# EAGLE design e0-dev-v004 (EAGLE 8.2.2)
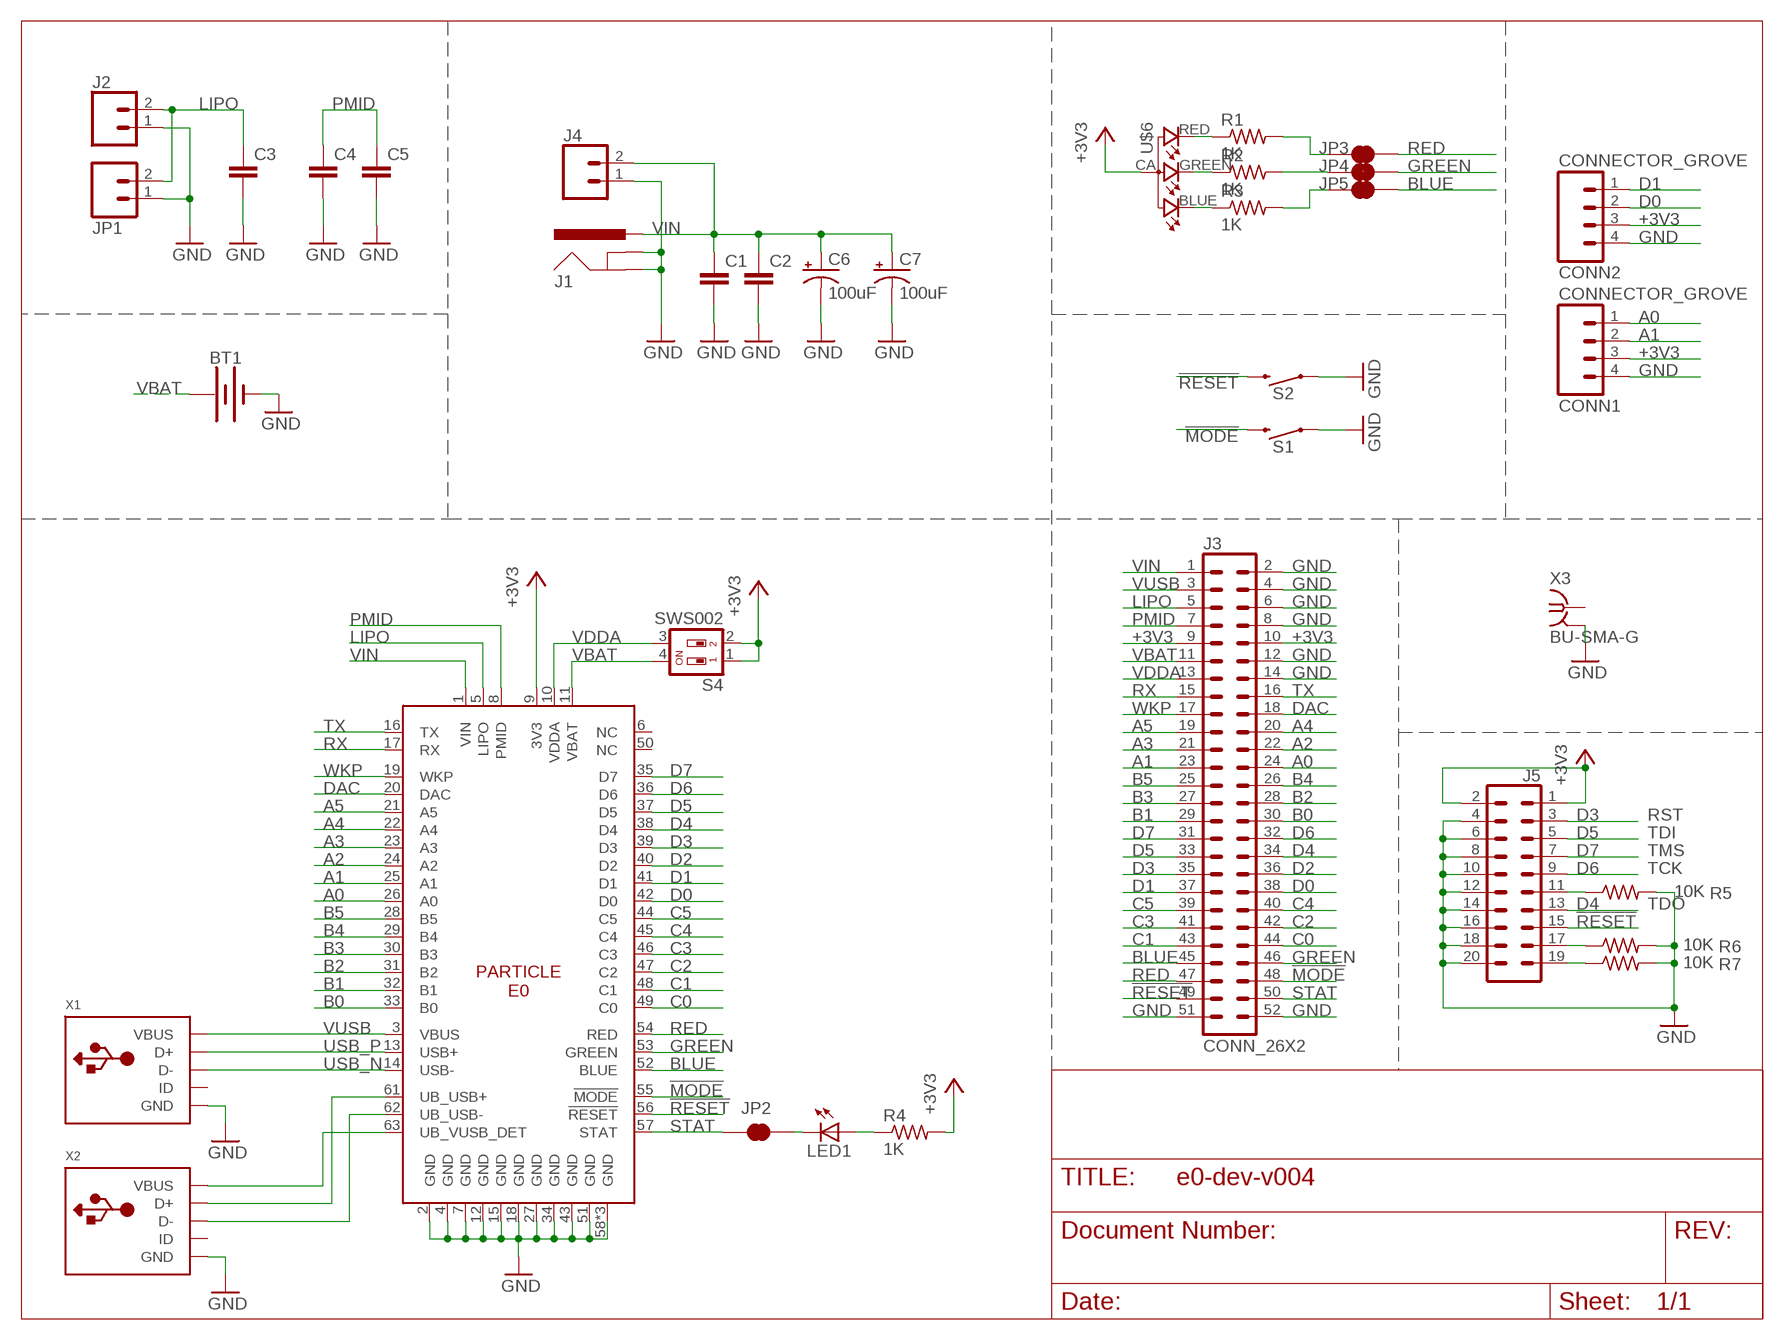
[diagram p0: schematic, sheet 1]

## Parts
BT1  BATTERY-20MM_SMD  [BATTCON_20MM]
C1  C-EUC0805  [C0805]
C2  C-EUC0805  [C0805]
C3  C-EUC0805  [C0805]
C4  C-EUC0805  [C0805]
C5  C-EUC0805  [C0805]
C6  100uF  100UF-POLAR-25V-20%(ELEC)  [PANASONIC_D]
C7  100uF  100UF-POLAR-25V-20%(ELEC)  [PANASONIC_D]
CONN1  CONNECTOR_GROVE  [CONNCTOR_GROVE]
CONN2  CONNECTOR_GROVE  [CONNCTOR_GROVE]
J1  POWER_JACKSLT  [POWER_JACK_SLOT]
J2  CONN_021X02_NO_SILK  [1X02_NO_SILK]
J3  CONN_26X2  [2X26]
J4  CONN_021X02_NO_SILK  [1X02_NO_SILK]
J5  CONN_10X2NOSILK  [2X10_NOSILK]
JP1  M02-JST-2MM-SMT  [JST-2-SMD@1]
JP2  JUMPER-SMT_2_NC_TRACE_NO-SILK  [SMT-JUMPER_2_NC_TRACE_NO-SILK]
JP3  JUMPER-SMT_2_NC_TRACE_NO-SILK  [SMT-JUMPER_2_NC_TRACE_NO-SILK]
JP4  JUMPER-SMT_2_NC_TRACE_NO-SILK  [SMT-JUMPER_2_NC_TRACE_NO-SILK]
JP5  JUMPER-SMT_2_NC_TRACE_NO-SILK  [SMT-JUMPER_2_NC_TRACE_NO-SILK]
LED1  LED0603  [LED-0603]
R1  1K  R-US_R0603  [R0603]
R2  1K  R-US_R0603  [R0603]
R3  1K  R-US_R0603  [R0603]
R4  1K  R-US_R0603  [R0603]
R5  10K  R-US_R0603  [R0603]
R6  10K  R-US_R0603  [R0603]
R7  10K  R-US_R0603  [R0603]
S1  MOMENTARY-SWITCH-SPST-SMD-5.2MM  [TACTILE_SWITCH_SMD_5.2MM]
S2  MOMENTARY-SWITCH-SPST-SMD-5.2MM  [TACTILE_SWITCH_SMD_5.2MM]
S4  SWS002  [SMS-002]
U1  E0_V005  [E0]
U$6  RGB-LED-CLMVB-FKARGB  [PLCC4-2MM-RGB]
X1  USB-NEW-PHOTON  [4UCONN_CMCUSB-5BFM14X-01-X]
X2  USB-NEW-PHOTON  [4UCONN_CMCUSB-5BFM14X-01-X]
X3  BU-SMA-G  [BU-SMA-G]

## Nets
!MODE: J3.48 S1.3 U1.55(!MODE)
!RESET: J3.49 J5.15 S2.3 U1.56(!RESET)
+3V3 [3V3]: CONN1.3 CONN2.3 J3.9 J3.10 J5.1 J5.2 R4.2 S4.1 S4.2 U1.9(3V3) U$6.CA
A0: CONN1.1 J3.24 U1.26(A0)
A1: CONN1.2 J3.23 U1.25(A1)
A2: J3.22 U1.24(A2)
A3: J3.21 U1.23(A3)
A4: J3.20 U1.22(A4)
A5: J3.19 U1.21(A5)
B0: J3.30 U1.33(B0)
B1: J3.29 U1.32(B1)
B2: J3.28 U1.31(B2)
B3: J3.27 U1.30(B3)
B4: J3.26 U1.29(B4)
B5: J3.25 U1.28(B5)
BLUE: J3.45 JP5.2 U1.52(BLUE)
C0: J3.44 U1.49(C0)
C1: J3.43 U1.48(C1)
C2: J3.42 U1.47(C2)
C3: J3.41 U1.46(C3)
C4: J3.40 U1.45(C4)
C5: J3.39 U1.44(C5)
D0: CONN2.2 J3.38 U1.42(D0)
D1: CONN2.1 J3.37 U1.41(D1)
D2: J3.36 U1.40(D2)
D3: J3.35 J5.3 U1.39(D3)
D4: J3.34 J5.13 U1.38(D4)
D5: J3.33 J5.5 U1.37(D5)
D6: J3.32 J5.9 U1.36(D6)
D7: J3.31 J5.7 U1.35(D7)
DAC: J3.18 U1.20(DAC)
GND: BT1.2(-) C1.2 C2.2 C3.2 C4.2 C5.2 C6.- C7.- CONN1.4 CONN2.4 J1.GND@1(GNDBREAK) J1.GND@2(GND) J2.1 J3.2 J3.4 J3.6 J3.8 J3.12 J3.14 J3.51 J3.52 J4.1 J5.4 J5.6 J5.8 J5.10 J5.12 J5.14 J5.16 J5.18 J5.20 JP1.1 R5.2 R6.2 R7.2 S1.1 S2.1 U1.2(GND) U1.4(GND) U1.7(GND) U1.12(GND) U1.15(GND) U1.18(GND) U1.27(GND) U1.34(GND) U1.43(GND) U1.51(GND) U1.58(GND) U1.59(GND) U1.60(GND) X1.P$1(GND) X1.P$6(GND) X1.P$7(GND) X1.P$8(GND) X1.P$9(GND) X1.P$10(GND) X1.P$11(GND) X2.P$1(GND) X2.P$6(GND) X2.P$7(GND) X2.P$8(GND) X2.P$9(GND) X2.P$10(GND) X2.P$11(GND) X3.2 X3.3 X3.4 X3.5
GREEN: J3.46 JP4.2 U1.53(GREEN)
LIPO [LIPO]: C3.1 J2.2 J3.5 JP1.2 U1.5(LIPO)
N$1: R1.1 U$6.RED
N$2: R2.1 U$6.GREEN
N$3: R3.1 U$6.BLUE
N$4: U1.63(UB_VUSB_DET) X2.P$5(VBUS)
N$5: JP4.1 R2.2
N$6: JP3.1 R1.2
N$7: JP5.1 R3.2
N$12: LED1.A R4.1
N$16: J5.11 R5.1
N$17: J5.17 R6.1
N$18: J5.19 R7.1
N$19: JP2.2 LED1.C
PMID [PMID]: C4.1 C5.1 J3.7 U1.8(PMID)
RED: J3.47 JP3.2 U1.54(RED)
RX: J3.15 U1.17(RX)
STAT: J3.50 JP2.1 U1.57(STAT)
TX: J3.16 U1.16(TX)
UB_USB_N [DIFF_PAIR]: U1.62(UB_USB-) X2.P$4(D-)
UB_USB_P [DIFF_PAIR]: U1.61(UB_USB+) X2.P$3(D+)
USB_N [DIFF_PAIR]: U1.14(USB-) X1.P$4(D-)
USB_P [DIFF_PAIR]: U1.13(USB+) X1.P$3(D+)
VBAT: BT1.1(+) J3.11 S4.4 U1.11(VBAT)
VDDA: J3.13 S4.3 U1.10(VDDA)
VIN [VIN]: C1.1 C2.1 C6.+ C7.+ J1.PWR J3.1 J4.2 U1.1(VIN)
VUSB: J3.3 U1.3(VBUS) X1.P$5(VBUS)
WKP: J3.17 U1.19(WKP)
Unconnected: U1.6(NC) U1.50(NC) X1.P$2(ID) X2.P$2(ID) X3.1

## Notes on the sheet
- RST
- TDI
- TMS
- TCK
- TDO

## Library data of the parts
BT1 = SparkFun-Batteries:BATTERY: Battery - Single Cell A variety of battery chemistries, sizes, and footprints. Device List: 20MM_PTH - Coin Cell Battery Holder - 20mm (PTH) <https://www.sparkfun.com/products/783> 12MM_SMD - Coin Cell Battery Holder - 12mm (SMD) <https://www.sparkfun.com/products/10592> 12MM_PTH - Coin Cell Battery Holder - 12mm (PTH) <https://www.sparkfun.com/products/7948> 20MM_SMD - 20mm Coin Cell Battery Holder (SMD) (2 legs) Used on the Big Time Watch Kit <https://www.sparkfun.com/products/11734> 20MM_SMD_4LEGS - Coin Cell Battery Holder - 20mm (SMD) <https://www.sparkfun.com/products/11892> 20MM_SMD_4LEGS_OVERPASTE - Coin Cell Battery Holder - 20mm (SMD) <https://www.sparkfun.com/products/11892> (Over-paste on the legs) 24.5MM_PTH - Coin Cell Battery Holder - 24.5mm (PTH) <https://www.sparkfun.com/products/8863> 9V - 9V Battery Holder - PC Mount Used on the SparkFun SparkPunk Sound Kit <https://www.sparkfun.com/products/11177> and SparkFun SparkPunk Sequencer Kit <https://www.sparkfun.com/products/12707> 18650 - Battery Holder - 18650 (PTH) <https://www.sparkfun.com/products/13113> AA - Battery Holder - 1xAA (PTH) <https://www.sparkfun.com/products/7949> AAA - Battery Holder - 1xAAA (PTH) <https://www.sparkfun.com/products/12718> AA_KIT - Battery Holder - 1xAA (PTH) <https://www.sparkfun.com/products/7949> Special kit package - pads only have exposed copper on one side of the board. AAA_KIT - Battery Holder - 1xAAA (PTH) <https://www.sparkfun.com/products/12718> Special kit package - pads only have exposed copper on one side of the board.; PROD_ID: BATT-11519
C1-C5 = rcl:C-EU: CAPACITOR, European symbol
C6 C7 = SparkFun-Capacitors:100UF-POLAR: 100µF polarized capacitors A capacitor is a passive two-terminal electrical component used to store electrical energy temporarily in an electric field.; PROD_ID: CAP-12547
CONN1 CONN2 = Particle:CONNECTOR
J1 = Particle:POWER_JACK: Power Jack This is the standard 5.5mm barrel jack for power. The PTH is the most common, proven, reliable, footprint. The Slot footprint only works if the mill layer is transmitted to the PCB fab house so be warned. Spark Fun Electronics SKU : PRT-00119 SMT: CONN-08106 Mating wall wart : TOL-00298 (and others)
J2 J4 = SparkFun-Connectors:CONN_02: Multi connection point. Often used as Generic Header-pin footprint for 0.1 inch spaced/style header connections On any of the 0.1 inch spaced packages, you can populate with these: Break Away Headers - Straight <https://www.sparkfun.com/products/116> (PRT-00116) Break Away Male Headers - Right Angle <https://www.sparkfun.com/products/553> (PRT-00553) Female Headers <https://www.sparkfun.com/products/115> (PRT-00115) Break Away Headers - Machine Pin <https://www.sparkfun.com/products/117> (PRT-00117) Break Away Female Headers - Swiss Machine Pin <https://www.sparkfun.com/products/743> (PRT-00743) For SCREWTERMINALS and SPRING TERMINALS visit here: Screw Terimnals on SparkFun.com <https://www.sparkfun.com/search/results?term=Screw+Terminals> (5mm/3.5mm/2.54mm spacing) This device is also useful as a general connection point to wire up your design to another part of your project. Our various solder wires solder well into these plated through hole pads. Hook-Up Wire - Assortment (Stranded, 22 AWG) <https://www.sparkfun.com/products/11375> (PRT-11375) Hook-Up Wire - Assortment (Solid Core, 22 AWG) <https://www.sparkfun.com/products/11367> (PRT-11367) View the entire wire category on our website here <https://www.sparkfun.com/categories/141> Special notes: Molex polarized connector foot print use with: PRT-08233 with associated crimp pins and housings. 2.54_SCREWTERM for use with PRT-10571. 3.5mm Screw Terminal footprints for PRT-08084 5mm Screw Terminal footprints for use with PRT-08432
J3 = SparkFun-Connectors:CONN_26X2: Multi connection point. Often used as Generic Header-pin footprint for 0.1 inch spaced/style header connections On any of the 0.1 inch spaced packages, you can populate with these: Break Away Headers - Straight <https://www.sparkfun.com/products/116> (PRT-00116) Break Away Male Headers - Right Angle <https://www.sparkfun.com/products/553> (PRT-00553) Female Headers <https://www.sparkfun.com/products/115> (PRT-00115) Break Away Headers - Machine Pin <https://www.sparkfun.com/products/117> (PRT-00117) Break Away Female Headers - Swiss Machine Pin <https://www.sparkfun.com/products/743> (PRT-00743)
J5 = SparkFun-Connectors:CONN_10X2: Multi connection point. Often used as Generic Header-pin footprint for 0.1 inch spaced/style header connections On any of the 0.1 inch spaced packages, you can populate with these: Break Away Headers - Straight <https://www.sparkfun.com/products/116> (PRT-00116) Break Away Male Headers - Right Angle <https://www.sparkfun.com/products/553> (PRT-00553) Female Headers <https://www.sparkfun.com/products/115> (PRT-00115) Break Away Headers - Machine Pin <https://www.sparkfun.com/products/117> (PRT-00117) Break Away Female Headers - Swiss Machine Pin <https://www.sparkfun.com/products/743> (PRT-00743) Special note about the "SPECIAL" package: This was SPECIALLY designed to be used with our Graphic LCD Backpack. Be sure you want to use this! It is not only staggered on each line of header holes, but IT IS ALSO offset of the center point of the top and bottom lines by 5 mil. This causes the headers to lock into place on the "standard" footprint on the LCD screen. The extra squares on the tdocu layer are there simply to reference other pins (if you were to actually populate a longer header than ten long - this is what we do with the backpacks).
JP1 = SparkFun-Connectors:M02: Standard 2-pin 0.1" header. Use with - straight break away headers ( PRT-00116) - right angle break away headers (PRT-00553) - swiss pins (PRT-00743) - machine pins (PRT-00117) - female headers (PRT-00115) Molex polarized connector foot print use with: PRT-08233 with associated crimp pins and housings. 2.54_SCREWTERM for use with PRT-10571. 3.5mm Screw Terminal footprints for PRT-08084 5mm Screw Terminal footprints for use with PRT-08432; PROD_ID: CONN-11443
JP2-JP5 = SparkFun-Jumpers:JUMPER-SMT_2_NC_TRACE: Normally closed trace jumper This jumper has a trace between two pads so it's normally closed (NC). Use a razor knife to open the connection. For best results follow the IPC guidelines for cutting traces: Cutout at least 0.063 mm (0.005 in). Remove all loose material to clean up the cut area. Seal the cut with an approved epoxy. Reapply solder to reclose the connection.
LED1 = SparkFun:LED: LEDs Standard schematic elements and footprints for 5mm, 3mm, 1206, and 0603 sized LEDs. 5mm - Spark Fun Electronics SKU : COM-00529 (and others)
R1-R7 = rcl:R-US_: RESISTOR, American symbol
S1 S2 = SparkFun-Switches:MOMENTARY-SWITCH-SPST: Momentary Switch (Pushbutton) - SPST Normally-open (NO) SPST momentary switches (buttons, pushbuttons). Variants PTH-12MM - 12mm square, through-hole Momentary Pushbutton Switch - 12mm Square <https://www.sparkfun.com/products/9190> (COM-09190) PTH-6.0MM, PTH-6.0MM-KIT - 6.0mm square, through-hole Mini Pushbutton Switch <https://www.sparkfun.com/products/97> (COM-00097) KIT package intended for soldering kit's - only one side of pads' copper is exposed. PTH-RIGHT-ANGLE-KIT - Right-angle, through-hole Right Angle Tactile Button <https://www.sparkfun.com/products/10791> - Used on SparkFun BigTime Watch Kit <https://www.sparkfun.com/products/11734> SMD-12MM - 12mm square, surface-mount Tactile Button - SMD (12mm) <https://www.sparkfun.com/products/12993> (COM-12993) Used on SparkFun PicoBoard <https://www.sparkfun.com/products/11888> SMD-4.5MM - 4.5mm Square Trackball Switch Used on SparkFun Blackberry Trackballer Breakout <https://www.sparkfun.com/products/13169> SMD-4.6MMX2.8MM - 4.60mm x 2.80mm, surface mount Used on SparkFun SAMD21 Mini Breakout <https://www.sparkfun.com/products/13664> SMD-5.2MM, SMD-5.2-REDUNDANT - 5.2mm square, surface-mount Mini Pushbutton Switch - SMD <https://www.sparkfun.com/products/8720> (COM-08720) Used on Arduino Pro Mini <https://www.sparkfun.com/products/11114> REDUNDANT package connects both switch circuits together SMD-6.0X3.5MM - 6.0 x 3.5mm, surface mount Momentary Reset Switch SMD <https://www.sparkfun.com/products/8229> (COM-08229) SMD-6.2MM-TALL - 6.2mm square, surface mount Tactile Button - SMD (6mm) <https://www.sparkfun.com/products/12992> Used on SparkFun Digital Sandbox <https://www.sparkfun.com/products/12651> SMD-RIGHT-ANGLE - Right-angle, surface mount Used on SparkFun Block for Intel® Edison - Arduino <https://www.sparkfun.com/products/13036>; PROD_ID: SWCH-08247; SF_SKU: COM-08720
S4 = smd-special:SWS002: SMD Dip Switch 2 pol.
U1 = Particle:E0: Particle E0
U$6 = Particle:RGB-LED-CLMVB-FKA: CREE CLMVB-FKA RGB LED 2mm x 2mm
X1 X2 = Particle:USB-NEW-PHOTON: USB Connectors USBMINIB - Surface Mount Female Mini-B USB Connector 4UConnector: 06564 Micro USB Conn with through hole tabs Part# 10103594-0001LF / MFG: (Amphenol FCI)
X3 = con-coax:BU-SMA-G: FEMALE SMA CONNECTOR Radiall distributor RS 193-9117; OC_FARNELL: unknown; OC_NEWARK: unknown

## Net classes
1 DIFF_PAIR: width 0.203 mm, clearance 0.203 mm
3 VIN: width 0.305 mm, clearance 0.508 mm
4 3V3: width 0.305 mm, clearance 0.508 mm
5 VBUS: width 0.305 mm, clearance 0.508 mm
6 LIPO: width 0.305 mm, clearance 0.508 mm
7 PMID: width 0.305 mm, clearance 0.508 mm

## Board
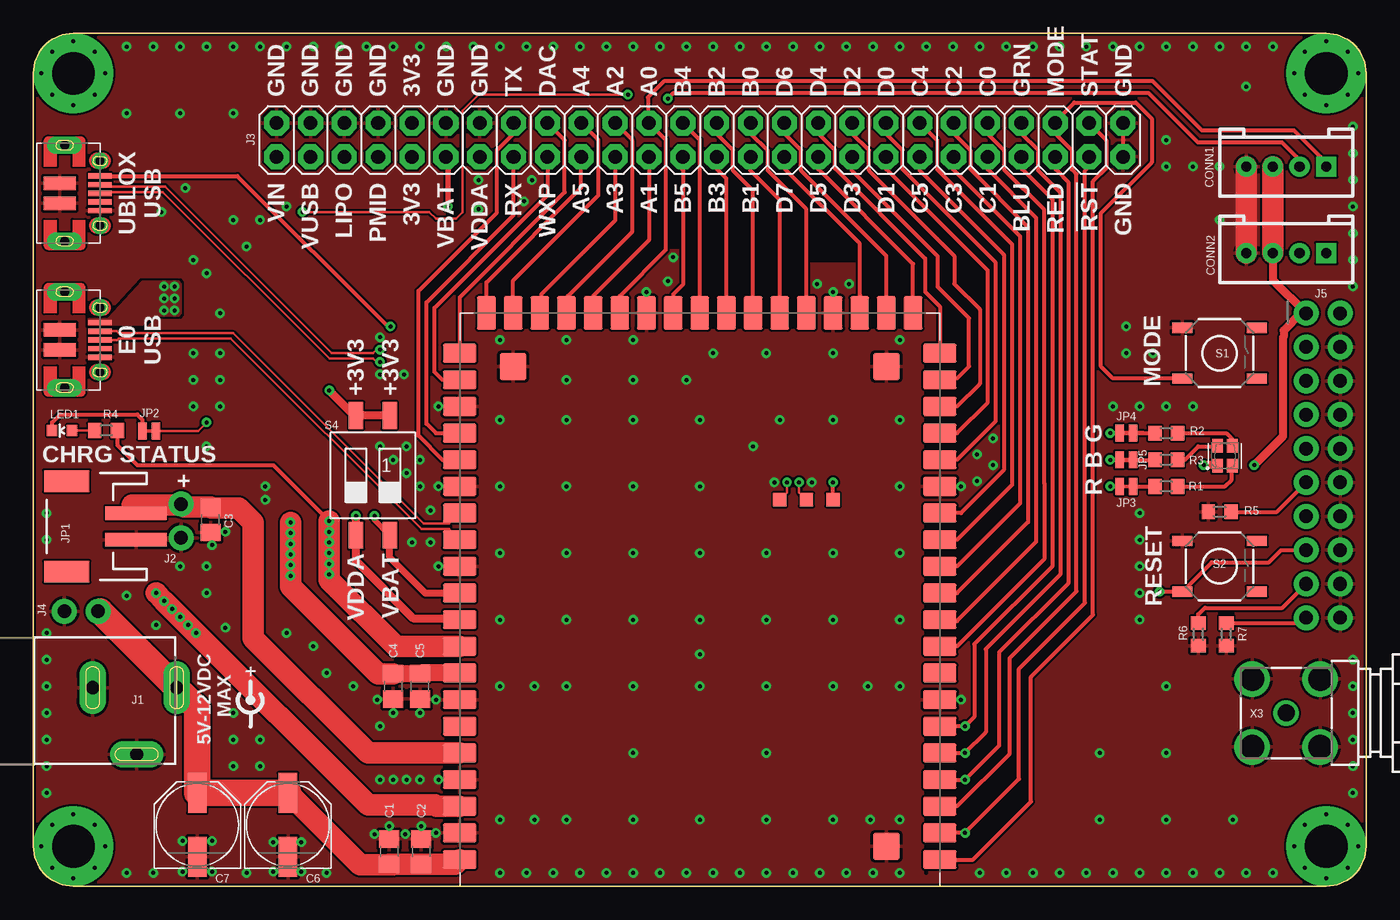
[diagram p1: board, top side]
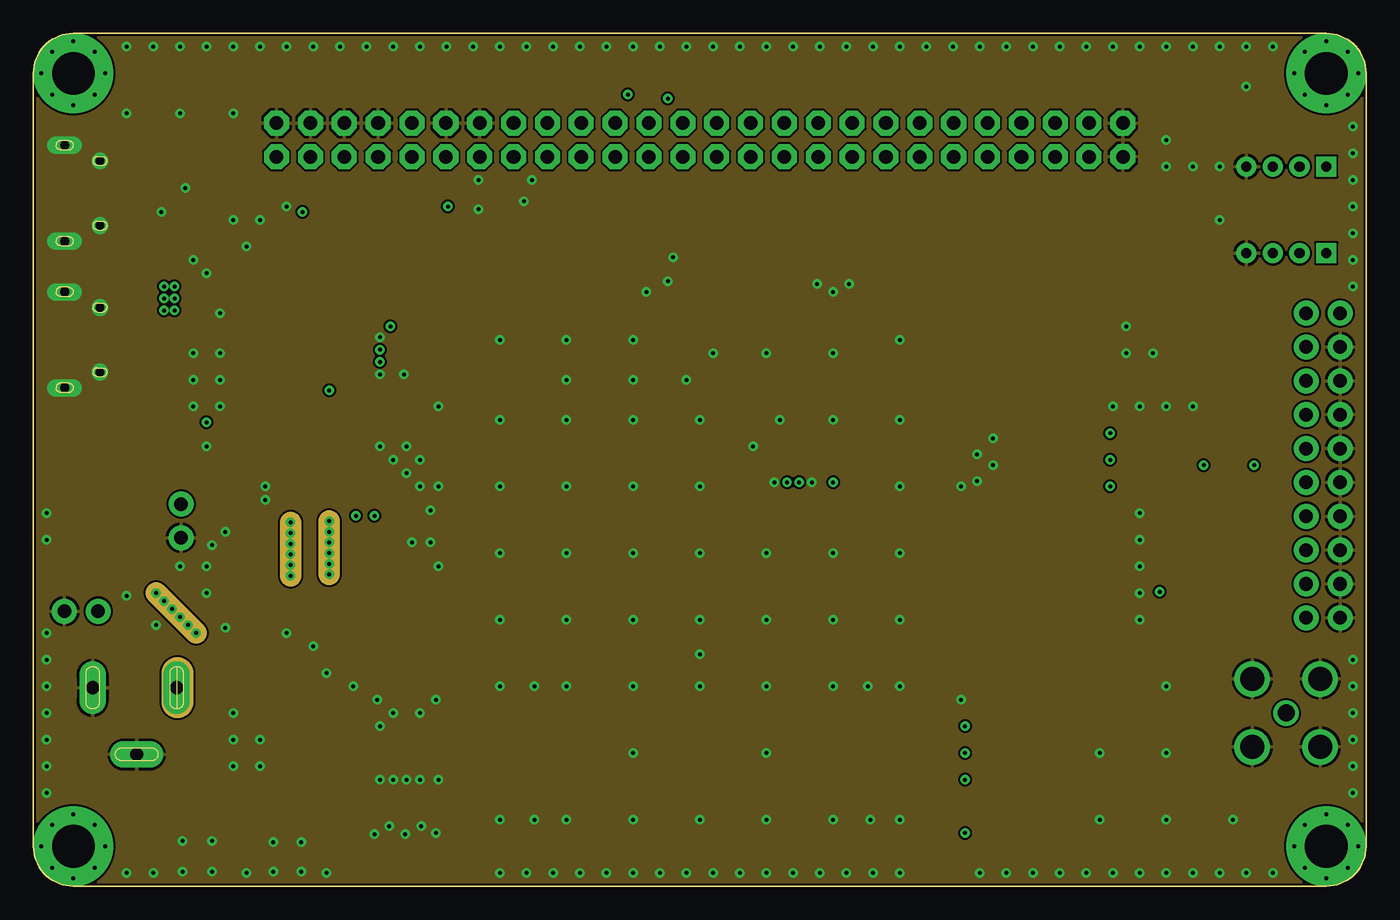
[diagram p2: board, inner layer Route2]
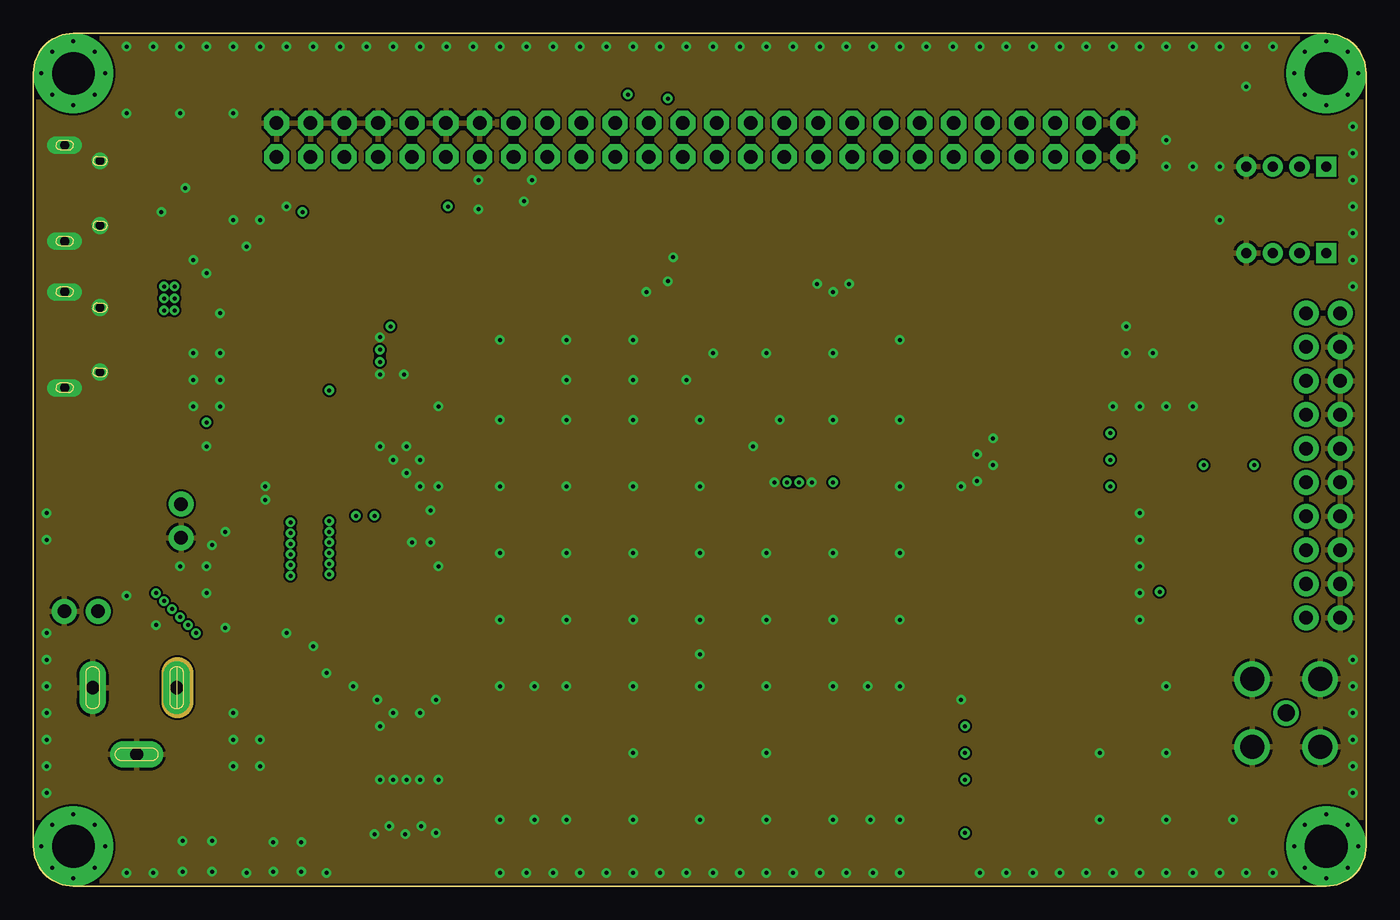
[diagram p3: board, inner layer Route3]
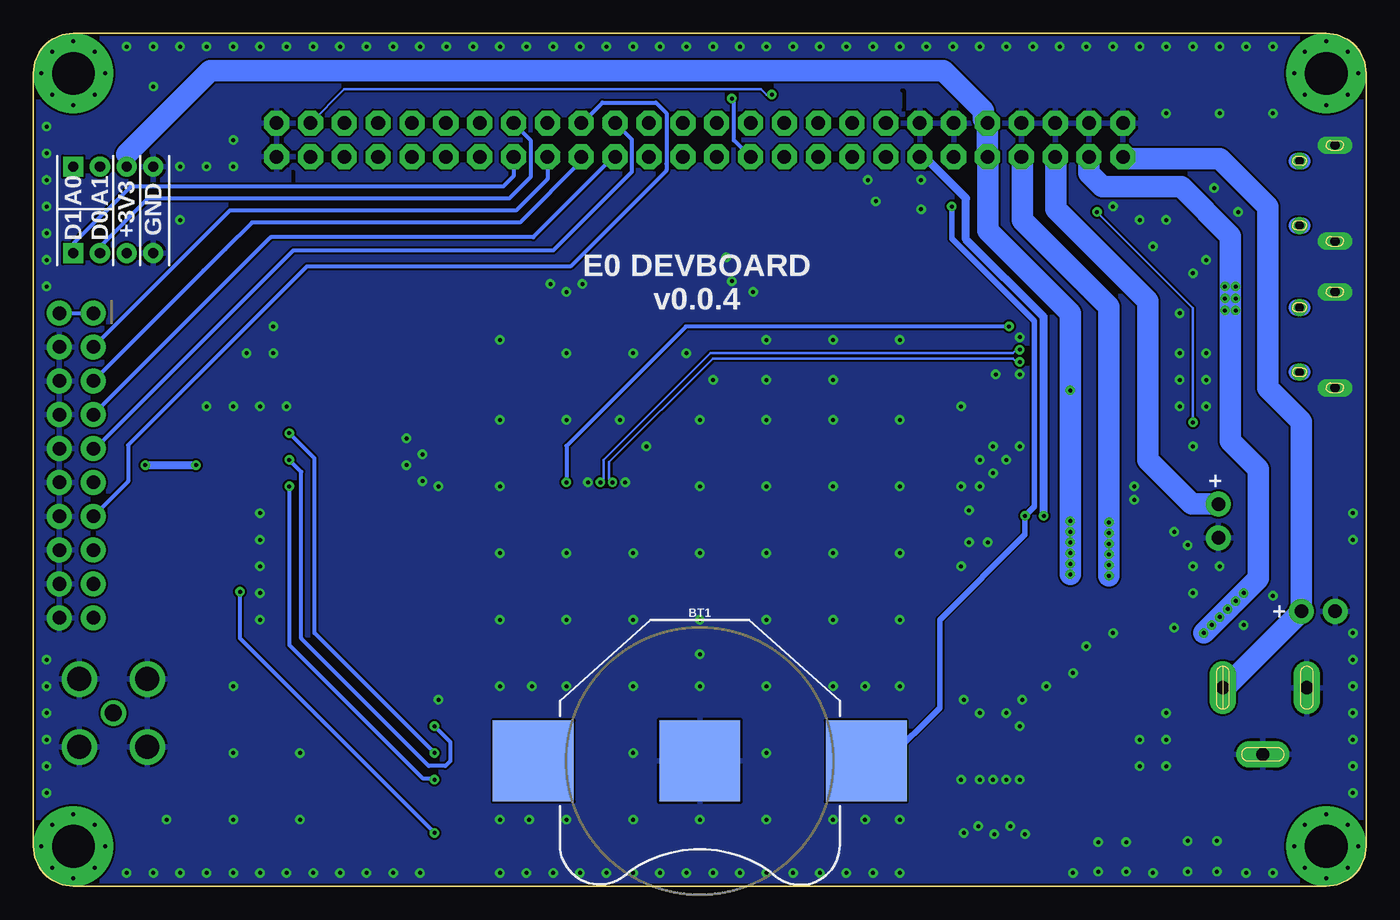
[diagram p4: board, bottom side, seen from below]

Size 100 x 64 mm. Coordinates in mm from the lower left corner, seen from the top.
Outline: 0,61 arc-90 3,64 97,64 arc-90 100,61 100,3 arc-90 97,0 3,0 arc-90 0,3 0,61
Copper layers (1+2*3+16): Top 0.018mm / dielectric 0.195mm / Route2 0.035mm / dielectric 1.1mm / Route3 0.035mm / dielectric 0.2mm / Bottom 0.018mm
Design rules "spark-4layer *": minimum track width 8mil, minimum drill 0.3mm, track to track 6mil, track to pad 6mil, pad to pad 6mil, via to via 6mil, smd to smd 0mil, copper to edge 6mil, drill to drill 6mil, minimum pad ring 12mil, minimum via ring 8mil, stop-mask expansion 4mil, vias tented up to drill 20mil, thermal gap 8mil
tRestrict: 8 lines
bRestrict: 3 lines

### Footprints (pad centres in the part's own frame; a part is rotated, then mirrored left to right if it is on the bottom)
BATTCON_20MM = smd 6.07 x 6.07: 1 -12.5,0; 2 0,0; 3 12.5,0
C0805 = smd 1.3 x 1.5: 1 -0.95,0; 2 0.95,0
PANASONIC_D = smd 3 x 1.4: + 2.4,0; - -2.4,0
CONNCTOR_GROVE = drill 0.762 pad 1.524 square: 1 -3,0 | drill 0.762 pad 1.524: 2 -1,0; 3 1,0; 4 3,0
POWER_JACK_SLOT = drill 1 pad 2 long: GND@1 2.58,7.5; GND@2 7.58,10.8; PWR 2.58,13.8
1X02_NO_SILK = drill 1.016 pad 1.88: 1 0,0; 2 2.54,0
2X26 = drill 1.016 pad 1.88 octagon: 1 -11.43,-1.27; 2 -11.43,1.27; 3 -8.89,-1.27; 4 -8.89,1.27; 5 -6.35,-1.27; 6 -6.35,1.27; 7 -3.81,-1.27; 8 -3.81,1.27; 9 -1.27,-1.27; 10 -1.27,1.27; 11 1.27,-1.27; 12 1.27,1.27; 13 3.81,-1.27; 14 3.81,1.27; 15 6.35,-1.27; 16 6.35,1.27; 17 8.89,-1.27; 18 8.89,1.27; 19 11.43,-1.27; 20 11.43,1.27; 21 13.97,-1.27; 22 13.97,1.27; 23 16.51,-1.27; 24 16.51,1.27; 25 19.05,-1.27; 26 19.05,1.27; 27 21.59,-1.27; 28 21.59,1.27; 29 24.13,-1.27; 30 24.13,1.27; 31 26.67,-1.27; 32 26.67,1.27; 33 29.21,-1.27; 34 29.21,1.27; 35 31.75,-1.27; 36 31.75,1.27; 37 34.29,-1.27; 38 34.29,1.27; 39 36.83,-1.27; 40 36.83,1.27; 41 39.37,-1.27; 42 39.37,1.27; 43 41.91,-1.27; 44 41.91,1.27; 45 44.45,-1.27; 46 44.45,1.27; 47 46.99,-1.27; 48 46.99,1.27; 49 49.53,-1.27; 50 49.53,1.27; 51 52.07,-1.27; 52 52.07,1.27
2X10_NOSILK = drill 1.016 pad 1.88: 1 0,0; 2 0,2.54; 3 2.54,0; 4 2.54,2.54; 5 5.08,0; 6 5.08,2.54; 7 7.62,0; 8 7.62,2.54; 9 10.16,0; 10 10.16,2.54; 11 12.7,0; 12 12.7,2.54; 13 15.24,0; 14 15.24,2.54; 15 17.78,0; 16 17.78,2.54; 17 20.32,0; 18 20.32,2.54; 19 22.86,0; 20 22.86,2.54
JST-2-SMD@1 = smd 1 x 4.6: 1 -1,-3.7; 2 1,-3.7 | smd 1.6 x 3.4: NC1 -3.4,1.5; NC2 3.4,1.5
SMT-JUMPER_2_NC_TRACE_NO-SILK = smd 0.635 x 1.27: 1 -0.508,0; 2 0.508,0
LED-0603 = smd 0.8 x 0.8: A 0,-0.75; C 0,0.75
R0603 = smd 1 x 1.1: 1 -0.85,0; 2 0.85,0
TACTILE_SWITCH_SMD_5.2MM = smd 1.524 x 0.762: 1 -2.794,1.905; 2 2.794,1.905; 3 -2.794,-1.905; 4 2.794,-1.905
SMS-002 = smd 1.092 x 2.007: 1 -1.27,-4.496; 2 1.27,-4.496; 3 1.27,4.496; 4 -1.27,4.496
E0 = smd 2.5 x 1.4: 1 -0.008,2; 2 -0.008,4; 3 -0.008,6; 4 -0.008,8; 5 -0.008,10; 6 -0.008,12; 7 -0.008,14; 8 -0.008,16; 9 -0.008,18; 10 -0.008,20; 11 -0.008,22; 12 -0.008,24; 13 -0.008,26; 14 -0.008,28; 15 -0.008,30; 16 -0.008,32; 17 -0.008,34; 18 -0.008,36; 19 -0.008,38; 20 -0.008,40; 38 36.008,40; 39 36.008,38; 40 36.008,36; 41 36.008,34; 42 36.008,32; 43 36.008,30; 44 36.008,28; 45 36.008,26; 46 36.008,24; 47 36.008,22; 48 36.008,20; 49 36.008,18; 50 36.008,16; 51 36.008,14; 52 36.008,12; 53 36.008,10; 54 36.008,8; 55 36.008,6; 56 36.008,4; 57 36.008,2 | smd 1.4 x 2.5: 21 2,43.008; 22 4,43.008; 23 6,43.008; 24 8,43.008; 25 10,43.008; 26 12,43.008; 27 14,43.008; 28 16,43.008; 29 18,43.008; 30 20,43.008; 31 22,43.008; 32 24,43.008; 33 26,43.008; 34 28,43.008; 35 30,43.008; 36 32,43.008; 37 34,43.008 | smd 2 x 2: 58 32,3; 59 32,39; 60 4,39 | smd 1 x 1: 61 24,29; 62 26,29; 63 28,29
PLCC4-2MM-RGB = smd 1 x 0.8: BLUE -0.75,-0.55; CA 0.75,-0.55; GREEN -0.75,0.55; RED 0.75,0.55
4UCONN_CMCUSB-5BFM14X-01-X = smd 0.4 x 1.75: P$1 -1.3,0; P$2 -0.65,0; P$3 0,0; P$4 0.65,0; P$5 1.3,0 | drill 0.65: P$6 2.425,0; P$7 -2.425,0 | drill 0.7 long: P$8 3.6,2.65; P$9 -3.6,2.65 | smd 1 x 2.4: P$10 0.75,3.035; P$11 -0.75,3.035
BU-SMA-G = drill 1.27: 1 0,0 | drill 1.778: 2 -2.55,2.55; 3 2.55,2.55; 4 2.55,-2.55; 5 -2.55,-2.55

### Placement (x,y rotation side)
BT1  50,9.4 180 bottom
C1  26.7,2.6 90 top
C2  29.1,2.6 90 top
C3  13.3,27.5 270 top
C4  27,15 270 top
C5  29,15 270 top
C6  19.1,4.6 90 top
C7  12.3,4.6 90 top
CONN1  94,54 180 top
CONN2  94,47.5 180 top
J1  -3.05,17.47 270 top
J2  11.08,26.14 90 top
J3  29.68,56 0 top
J4  2.33,20.63 0 top
J5  95.5,43 270 top
JP1  4,27 90 top
JP2  8.69,34.15 180 top
JP3  82,30 180 top
JP4  82,34 0 top
JP5  82,32 0 top
LED1  2.16,34.19 90 top
R1  85,30 180 top
R2  85,34 180 top
R3  85,32 180 top
R4  5.46,34.19 0 top
R5  89,28.1 180 top
R6  87.4,18.9 270 top
R7  89.5,18.9 270 top
S1  89,40 0 top
S2  89,24 0 top
S4  25.48,30.83 180 top
U1  32,0 0 top
U$6  89.4,32.29 270 top
X1  5,41 90 top
X2  5,52 90 top
X3  94,13 0 top

### Tracks (layer width: path | path; a pad name or v marks a point on that pad's centre or on a via)
!MODE
  Top 0.3: U1.55 69.3,6 73.25,9.95 73.25,17.11 78.26,22.12 78.26,53.44 77.91,53.79 77.91,55.24 76.67,56.49 J3.48 76.67,57.37 78.1,58.8 82.7,58.8 83.9,57.6 83.9,54.3 80.11,50.51 80.11,38.99 81,38.09 S1.3
!RESET  (via drill 0.3)
  Top 0.3: J3.49 79.21,54.01 78.9,53.7 78.9,21.26 73.95,16.31 73.95,8.05 v69.9,4 U1.56 | S2.3 88.41,24.3 92.7,24.3 93.62,25.22 J5.15
  Top 0.305: S2.3 v84.5,22.1
  Bottom 0.305: v69.9,4 84.5,18.6 v84.5,22.1
+3V3  (via drill 0.3)
  Top 0.3: 93,46.9 CONN2.3 | R4.2 6.31,33.09 7.8,31.6 18,31.6 v22.2,27.4 | v22.2,23.4 v22.2,25 | v22.2,25 v22.2,26.6 | v22.2,25 | v22.2,25 v22.2,26.6 | v22.2,24.2 v22.2,25 | v22.2,25 v22.2,26.6 | v22.2,25.8 v22.2,25
  Top 0.61: CONN2.3 93,45.5 J5.1 95.1,43 93.8,41.7 93.8,41.24 93.75,41.19 93.75,33.75 v91.6,31.6 | U$6.CA 88.79,31.6 v87.8,31.6 | S4.1 S4.2 24.08,35.32 v22.2,37.2
  Top 1.6: U1.9 27.2,18 22.2,23 v22.2,25 v22.2,26.6 v22.2,27.4 | CONN2.3 CONN1.3
  Route2 1.6: v22.2,23.4 v22.2,27.4
  Bottom 0.3: J5.2 J5.1
  Bottom 0.61: v91.6,31.6 v87.8,31.6 | CONN1.3 93,54.93
  Bottom 1.6: v22.2,23.4 v22.2,26.6 v22.2,37.2 22.2,43 28.4,49.2 J3.9 J3.10 28.7,57.56 28.7,58.2 31.7,61.2 86.73,61.2 93,54.93
A0
  Top 0.3: 46.28,57.18 J3.24 | 46.28,57.18 47.43,56.03 47.43,47.73 44,44.3 U1.26 | CONN1.1 97,54.3 94.6,56.7 87.7,56.7 84,60.4 47.3,60.4 46.1,59.2 46.1,57.36 46.28,57.18
A1  (via drill 0.3)
  Top 0.3: J3.23 46.19,48.49 42,44.3 U1.25 | CONN1.2 95,54.5 93.7,55.8 87.4,55.8 83.7,59.5 48,59.5 v47.6,59.1
  Bottom 0.3: v47.6,59.1 47.43,58.93 47.43,55.97 J3.23
A2
  Top 0.3: J3.22 44.9,56.02 44.9,49.1 40.1,44.3 40.1,43.11 U1.24
A3
  Top 0.3: 43.6,54.68 J3.21 43.65,49.95 38.1,44.4 38.1,43.11 U1.23
A4
  Top 0.3: J3.20 42.4,55.98 42.4,51.84 36,45.44 U1.22
A5
  Top 0.3: J3.19 41.11,52.42 34,45.31 U1.21
B0
  Top 0.3: J3.30 53.81,56.49 55.1,55.2 55.1,53.7 58,50.8 U1.33
B1
  Top 0.3: U1.32 56,51.5 53.8,53.7 J3.29
B2
  Top 0.3: J3.28 51.27,56.49 52.51,55.24 52.51,53.69 54,52.2 U1.31
B3
  Top 0.3: U1.30 52,53.1 51.3,53.8 51.3,54.7 J3.27
B4
  Top 0.3: U1.29 50,56 J3.26
B5
  Top 0.3: 48.7,53.8 48.7,54.7 J3.25 48.73,45.13 48,44.4 U1.28
BLUE  (via drill 0.3)
  Top 0.3: J3.45 74.2,54.66 74.2,53.8 76.44,51.56 76.44,24.01 70.6,18.17 70.6,12.7 v69.9,12 U1.52 | JP5.2 v80.8,32
  Bottom 0.3: v69.9,12 68.7,10.8 68.7,9.4 69.07,9.03 70.33,9.03 79.9,18.6 79.9,31.1 v80.8,32
C0
  Top 0.3: J3.44 71.59,56.49 72.83,55.24 72.83,53.77 75.84,50.76 75.84,30.25 | U1.49 69.3,18 75.84,24.54 75.84,30.25 | 75.84,30.24 75.84,30.25
C1
  Top 0.3: U1.48 68.11,19.9 69.3,19.9 75.23,25.83 75.23,50.17 71.6,53.8 J3.43
C2
  Top 0.3: J3.42 69.05,56.49 70.29,55.24 70.29,53.81 74.63,49.47 74.63,27.33 69.3,22 U1.47
C3
  Top 0.3: U1.46 69.3,24 74.02,28.72 74.02,48.78 69,53.8 69,54.73 J3.41
C4
  Top 0.3: J3.40 67.8,55.98 67.8,53.8 73.42,48.18 73.42,30.12 69.3,26 U1.45
C5
  Top 0.3: J3.39 66.5,53.7 72.81,47.39 72.81,31.21 69.6,28 U1.44
D0
  Top 0.3: U1.42 69.3,32 72.21,34.91 72.21,46.79 65.21,53.79 65.21,55.24 63.97,56.49 J3.38
  Bottom 0.3: CONN2.2 95,48 91.4,51.6 64.3,51.6 62.7,53.2 62.7,56 J3.38
D1
  Top 0.3: U1.41 69.3,34 71.61,36.3 71.61,46.2 64,53.8 64,54.7 J3.37
  Bottom 0.3: CONN2.1 97,48.2 92.7,52.5 64.75,52.5 63.97,53.28 J3.37
D2
  Top 0.3: J3.36 61.43,56.49 62.7,55.22 62.7,53.7 69.1,47.3 69.1,45.19 71,43.29 71,37.7 69.3,36 U1.40
D3
  Top 0.3: U1.39 68.11,38.1 69.3,38.1 70.2,39 70.2,42.61 67.85,44.96 67.85,47.25 61.4,53.7 61.4,54.7 J3.35
  Bottom 0.3: J5.3 85.26,50.7 63.8,50.7 61.43,53.07 J3.35 61.4,54.7 61.4,53.8
D4
  Top 0.3: J3.34 58.89,56.49 60.13,55.24 60.13,53.87 66.9,47.1 66.9,44.61 68,43.51 U1.38
  Bottom 0.3: J3.34 58.83,57.27 57.3,58.8 53.3,58.8 52.51,58.01 52.51,54.22 52.5,54.2 52.5,53.7 59.7,46.5 79.48,46.5 92.89,33.09 92.89,30.37 J5.13
D5
  Top 0.3: 65.9,43.11 U1.37 66,46.7 58.9,53.8 J3.33
  Bottom 0.3: J5.5 87.22,46.2 87.2,46.2 85.69,47.71 | 85.69,47.71 85.61,47.8 | J3.33 58.89,54.41 63.5,49.8 83.6,49.8 85.69,47.71
D6
  Top 0.3: J3.32 56.35,56.49 57.6,55.24 57.6,53.7 64,47.3 U1.36 63.9,43.11
  Bottom 0.3: J5.9 95.36,32.84 81.64,46.56 | 81.64,46.56 81.61,46.59 | J3.32 55.1,56.02 55.1,55.6 55.11,55.59 55.11,53.59 61,47.7 80.5,47.7 81.64,46.56
D7
  Top 0.3: 62,44.4 U1.35 62,48.2 56.4,53.8 56.4,54.68 J3.31
  Bottom 0.3: J3.31 56.47,54.73 62.5,48.7 82.18,48.7 J5.7
DAC
  Top 0.3: U1.20 32,44.2 39.87,52.07 39.87,55.97 J3.18
GND  (via drill 0.3)
  Top 0.3: J3.52 J3.51
  Top 1.6: CONN1.4 CONN2.4
  other vias: 25.6,3.9 26.7,4.5 29.1,4.5 30.2,4 30.4,8 27,13 29,13 25.8,14 30.2,14 30.4,24 30.4,30 30.4,36 46,44.6 60,44.6 69.6,30 69.6,14 11.2,3.4 13.4,3.4 13.4,1.1 11.2,1.1 20.1,1.1 18,3.3 18,1.1 13.4,25.6 14.4,26.6 26,38.4 26,41.2 58.4,30.3 55.6,30.3 20.1,3.3 27.9,3.9 9,63 11,63 13,63 15,63 17,63 19,63 21,63 23,63 25,63 27,63 29,63 31,63 33,63 35,63 37,63 39,63 41,63 43,63 45,63 47,63 49,63 51,63 53,63 55,63 57,63 59,63 61,63 63,63 65,63 67,63 69,63 71,63 73,63 75,63 77,63 79,63 81,63 83,63 85,63 87,63 89,63 91,63 93,63 7,63 1,26 1,28 1,19 1,17 1,15 1,13 1,11 1,9 1,7 7,1 9,1 16,1 22,1 35,1 37,1 39,1 41,1 43,1 45,1 47,1 49,1 51,1 53,1 55,1 57,1 59,1 61,1 63,1 65,1 93,1 91,1 89,1 87,1 85,1 83,1 81,1 79,1 77,1 75,1 73,1 71,1 99,7 99,9 99,11 99,13 99,15 99,17 99,45 99,47 99,49 99,51 99,53 99,55 99,57 12,47 13,46 12,40 12,38 12,36 14,36 14,38 14,40 14,43 13,33 11,24 13,24 13,22 15,9 17,9 17,11 15,11 15,13 21,18 19,19 22,16 24,15 26,12 29,8 27,8 26,8 28,8 28,31 29,30 26,33 28,33 29,32 27,32 15,50 17,50 16,48 85,54 87,54 89,54 89,50 82,40 82,42 84,40 81,36 83,36 85,36 87,36 83,28 83,26 83,24 83,22 83,20 35,5 40,5 45,5 50,5 55,5 60,5 65,5 37.6,15 35,15 35,20 35,25 35,30 35,35 40,35 45,35 50,35 65,35 65,30 65,25 65,20 65,15 62.8,5 62.6,15 55,10 50,17.4 45,10 37.6,5 40,15 40,20 40,25 40,30 45,30 50,30 50,25 45,25 45,20 45,15 50,15 55,15 60,15 60,20 60,25 55,25 55,20 50,20 55,40 60,40 80,5 85,5 90,5 85,10 85,15 17.4,30 17.4,29 29.8,25.8 29.8,28.2 28.4,25.8 27.8,38.4 60,35 56,35 51,40 40,38 45,38 49,38 45,41 40,41 35,41 54,33 65,41 80,10 7,58 11,58 15,58 91,60 85,56 7,21.8 9.2,19.6 14.4,19.4 47.6,45.4 48,47.2 58.8,45.2 61.2,45.2 72,33.6 72,31.6 70.8,30.4 70.8,32.4 11.4,52.4 9.6,50.6 36.8,51.4 37.4,53 33.4,53 33.4,50.8 19,51
  pour Route2: 0,0 100,0 100,64 0,64
  pour Top (rank 2): 0,0 0,64 100,64 100,0
  pour Bottom: 0,0 100,0 100,64 0,64
  pour Route3: 0,0 100,0 100,64 0,64
GREEN  (via drill 0.3)
  Top 0.3: J3.46 74.13,56.49 75.4,55.22 75.4,53.7 77.05,52.05 77.05,23.4 71.45,17.8 71.45,11.55 v69.9,10 U1.53 | JP4.2 83.3,34 81.4,34 | 81.4,34 v80.8,34 | v80.8,34 81.4,34 | v80.8,34 81.4,34
  Bottom 0.3: v69.9,10 78.9,19 78.9,32.1 v80.8,34
LIPO
  Top 0.508: 7.4,28.6 7.7,28.3 JP1.2
  Top 1.6: 7.4,28.6 11.01,28.6 J2.2 11.31,28.45 C3.1 13.35,28.4 15.4,28.4 16.5,27.3 16.5,18.6 25.1,10 U1.5
  Bottom 1.6: J3.5 23.3,54.7 23.3,50.8 16.4,43.9 16.4,32 13.07,28.68 J2.2
N$1
  Top 0.3: R1.1 89.4,30 89.9,30.5 89.9,31.49 U$6.RED
N$2
  Top 0.3: R2.1 89.5,34 89.9,33.6 89.9,33.09 U$6.GREEN
N$3
  Top 0.3: R3.1 86.4,32 87.4,33 88.81,33 U$6.BLUE
N$4  (via drill 0.3)
  Top 0.3: X2.P$5 15.3,53.3 26.6,42 v26.8,42 | U1.63 v60,30.3
  Bottom 0.3: v26.8,42 48.4,42 | 50,42 51.04,42 60,33.04
  Bottom 0.305: 48.4,42 50,42 | 60,33.04 v60,30.3
N$5
  Top 0.3: 83.28,34 R2.2 | 83.28,34 83.13,34 | 80.8,34 JP4.1 83.28,34
N$6
  Top 0.3: JP3.1 R1.2
N$7
  Top 0.3: 80.8,32 JP5.1 | JP5.1 81.69,32 | JP5.1 R3.2
N$8  (via drill 3.2 pad 6)
  other vias: 3,3
N$9  (via drill 3.2 pad 6)
  other vias: 3,61
N$10  (via drill 3.2 pad 6)
  other vias: 97,61
N$11  (via drill 3.2 pad 6)
  other vias: 97,3
N$12
  Top 0.2: LED1.A R4.1
N$13  (via drill 0.3)
  other vias: 3,63.4
N$14  (via drill 0.3)
  other vias: 5.4,61
N$15  (via drill 0.3)
  other vias: 3,58.6
N$16
  Top 0.3: R5.1 93.3,28.1 J5.11
N$17
  Top 0.3: R6.1 87.4,20.4 87.9,20.9 93.72,20.9 J5.17
N$18
  Top 0.3: R7.1 95.11,19.75 J5.19
N$19
  Top 0.3: LED1.C 1.41,34.81 2,35.4 5.54,35.4 7.8,35.4 8.2,35 8.2,34.63 8.18,34.61 JP2.2
N$20  (via drill 0.3)
  other vias: 0.6,61
N$21  (via drill 0.3)
  other vias: 1.4,62.6
N$22  (via drill 0.3)
  other vias: 1.4,59.4
N$23  (via drill 0.3)
  other vias: 4.6,59.4
N$24  (via drill 0.3)
  other vias: 4.6,62.6
N$25  (1 unrouted)
  Route2 2.4: 10.8,16 10.8,13.8
  Route3 2.4: 10.8,16 10.8,13.8
N$26  (via drill 0.3)
  other vias: 97,63.4
N$27  (via drill 0.3)
  other vias: 99.4,61
N$28  (via drill 0.3)
  other vias: 97,58.6
N$29  (via drill 0.3)
  other vias: 94.6,61
N$30  (via drill 0.3)
  other vias: 95.4,62.6
N$31  (via drill 0.3)
  other vias: 95.4,59.4
N$32  (via drill 0.3)
  other vias: 98.6,59.4
N$33  (via drill 0.3)
  other vias: 98.6,62.6
N$35  (via drill 0.3)
  other vias: 97,5.4
N$36  (via drill 0.3)
  other vias: 99.4,3
N$37  (via drill 0.3)
  other vias: 97,0.6
N$38  (via drill 0.3)
  other vias: 94.6,3
N$39  (via drill 0.3)
  other vias: 95.4,4.6
N$40  (via drill 0.3)
  other vias: 95.4,1.4
N$41  (via drill 0.3)
  other vias: 98.6,1.4
N$42  (via drill 0.3)
  other vias: 98.6,4.6
N$44  (via drill 0.3)
  other vias: 3,5.4
N$45  (via drill 0.3)
  other vias: 5.4,3
N$46  (via drill 0.3)
  other vias: 3,0.6
N$47  (via drill 0.3)
  other vias: 0.6,3
N$48  (via drill 0.3)
  other vias: 1.4,4.6
N$49  (via drill 0.3)
  other vias: 1.4,1.4
N$50  (via drill 0.3)
  other vias: 4.6,1.4
N$51  (via drill 0.3)
  other vias: 4.6,4.6
PMID  (via drill 0.3)
  Top 0.3: v19.3,24.1 v19.3,26.5 | v19.3,25.7 v19.3,26.5 | v19.3,24.9 v19.3,26.5
  Top 1.27: U1.8 29.05,16 C5.1 C4.1
  Top 1.6: C4.1 25.85,15.95 19.3,22.5 v19.3,26.5 v19.3,27.3
  Route2 1.6: v19.3,23.3 v19.3,27.3
  Bottom 1.6: J3.7 25.8,54.66 25.8,50 19.3,43.5 v19.3,26.5 v19.3,23.3
RED  (via drill 0.3)
  Top 0.3: J3.47 76.7,54.7 76.7,53.8 77.65,52.85 77.65,22.73 72.45,17.53 72.45,10.55 v69.9,8 U1.54 | 80.91,30 v80.8,30 | 81.01,30 JP3.2 | 81.01,30 v80.8,30 | v80.8,30 81.01,30
  Bottom 0.3: v69.9,8 70,8.1 70.8,8.1 80.8,18.1 v80.8,30
RX
  Top 0.3: U1.17 30.2,34 29.5,34.7 29.5,43.81 36.03,50.34 J3.15
STAT  (via drill 0.3)
  Top 0.2: JP2.1 12.35,34.15 v13,34.8 | v20.2,50.6 29.7,50.6 30.2,50.1 31.7,50.1 32.2,50.6 32.2,58.2 33.4,59.4 v44.6,59.4
  Top 0.3: 69.2,2 U1.57 70.5,2 74.85,6.35 74.85,15.71 79.5,20.36 79.5,52.91 80.5,53.9 80.5,55.98 J3.50 79.03,57.27
  Bottom 0.2: v20.2,50.6 13,43.4 v13,34.8 | v44.6,59.4 45.01,59.4 45.4,59.79 76.69,59.79 J3.50
TX
  Top 0.3: J3.16 36.03,56.49 34.79,55.24 34.79,50.55 28.89,44.66 28.89,33.81 30.7,32 U1.16
UB_USB_N  (via drill 0.3)
  Top 0.203: U1.62 57.45,29.55 v57.45,30.3 | v26,40.26 25.75,40.26 25.5,40 22.38,40 9.88,52.5 6,52.5 6,52.51 5.14,52.51 X2.P$4
  Bottom 0.203: v26,40.26 26.25,40.26 26.5,40 49.18,40 57.2,31.98 57.2,30.55 v57.45,30.3
UB_USB_P  (via drill 0.3)
  Top 0.203: 56,29.2 U1.61 56.55,29.55 v56.55,30.3 | v26,39.34 25.75,39.34 25.5,39.6 22.22,39.6 9.72,52.1 5.1,52.1 X2.P$3
  Bottom 0.203: v26,39.34 26.25,39.34 26.5,39.6 49.02,39.6 56.8,31.82 56.8,30.55 v56.55,30.3
USB_N
  Top 0.203: X1.P$4 6.25,41.65 6.4,41.5 14.98,41.5 29.28,27.2 31.2,27.2 U1.14
USB_P
  Top 0.203: X1.P$3 6.3,41 6.4,41.1 14.82,41.1 29.12,26.8 31.2,26.8 U1.13 31.3,26
VBAT  (via drill 0.3)
  Top 0.4: S4.4 25.6,27.48 v25.6,27.8 | 30.9,54.68 J3.11 31.1,54.58 v31.1,51
  Top 0.508: S4.4 26.75,24.65 29.4,22 U1.11
  Bottom 0.4: v31.1,51 31.1,48.6 24.91,42.41 24.91,28.49 v25.6,27.8 25.6,26.4 32,20 32,13.4 36,9.4 BT1.1
VDDA  (via drill 0.3)
  Top 0.61: U1.10 31.89,20.1 28.5,20.1 24.21,24.39 S4.3 24.21,27.69 24.2,27.7 v24.2,27.8
  Bottom 0.61: J3.13 33.13,54.73 30.01,51.61 30.01,48.53 24.2,42.72 v24.2,27.8
VIN
  Top 0.3: C1.1 26.76,1.59 27,1.59
  Top 1.6: C6.+ 24.51,1.59 27,1.59 | C1.1 C2.1 31.64,1.65 U1.1 | J4.2 5.01,20.63
  Top 2: C6.+ C7.+ 12.3,13.34 J1.PWR 5.01,20.63
  Bottom 1.6: J1.PWR 10.61,14.89 J4.2 4.87,34.87 7.4,37.4 7.4,51 11,54.6 18.12,54.6 J3.1
VUSB  (via drill 0.3)
  Top 0.3: v9.2,22 9.78,21.42 | v9.8,21.4 v10.4,20.8 | v11,20.2 v11.59,19.61 v11.6,19.6
  Top 1.6: U1.3 30.25,6 30.15,6.1 25.1,6.1 v11.59,19.61 v10.4,20.8 9.78,21.42 v9.2,22
  Route2 1.6: v9.2,22 v12.2,19
  Bottom 0.3: v9.8,45 10.2,45.4 10.2,45.9
  Bottom 1.6: v12.2,19 v9.2,22 8.1,23.1 8.1,31.3 10.2,33.4 10.2,45.9 10.2,48.8 13.88,52.48 19.18,52.48 19.2,52.5 19.8,52.5 20.79,53.49 J3.3
  other vias: 9.8,43.2 10.6,43.2 10.6,44.1 9.8,44.1 10.6,45
  pour Top (no thermals): 4.1,42.1 8.2,42.1 8.9,42.8 10.9,42.8 11.1,43 11.1,45.2 10.9,45.4 8.2,45.4 5.6,42.6 4.1,42.6
WKP
  Top 0.3: U1.19 30.7,38 30.1,38.6 30.1,43.4 38.6,51.9 38.6,54.7 J3.17

### Text on the board
tPlace: GND | GND | GND | GND | 3V3 | GND | GND | TX | DAC | A4 | A2 | A0 | B4 | B2 | B0 | D6 | D4 | D2 | D0 | C4 | C2 | C0 | GRN | MODE | STAT | GND | VIN | VUSB | LIPO | PMID | 3V3 | VBAT | VDDA | RX | WXP | A5 | A3 | A1 | B5 | B3 | B1 | D7 | D5 | D3 | D1 | C5 | C3 | C1 | BLU | RED | !RST | GND | UBLOX / USB | E0 / USB | MODE | +3V3 | +3V3 | G | CHRG STATUS | B | + | R | VDDA | VBAT | RESET | + | 5V-12VDC / MAX
bPlace: A1 | A0 | GND | +3V3 | D0 | D1 | E0 DEVBOARD / v0.0.4 | + | +